# EAGLE schematic passive_high_pass (EAGLE 7.3.0)
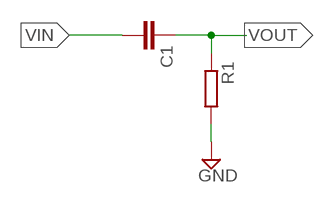
[diagram p0: schematic, sheet 1]

## Parts
C1  C5/2.5  [C5B2.5]
R1  R-EU_0204/5  [0204/5]

## Nets
GND: R1.2
VIN: C1.2
VOUT: C1.1 R1.1

## Library data of the parts
C1 = capacitor-wima:C: CAPACITOR naming: grid - package width
R1 = resistor:R-EU_: RESISTOR, European symbol